# EAGLE design ENC28J60Breakout_V02 (EAGLE 8.0.0)
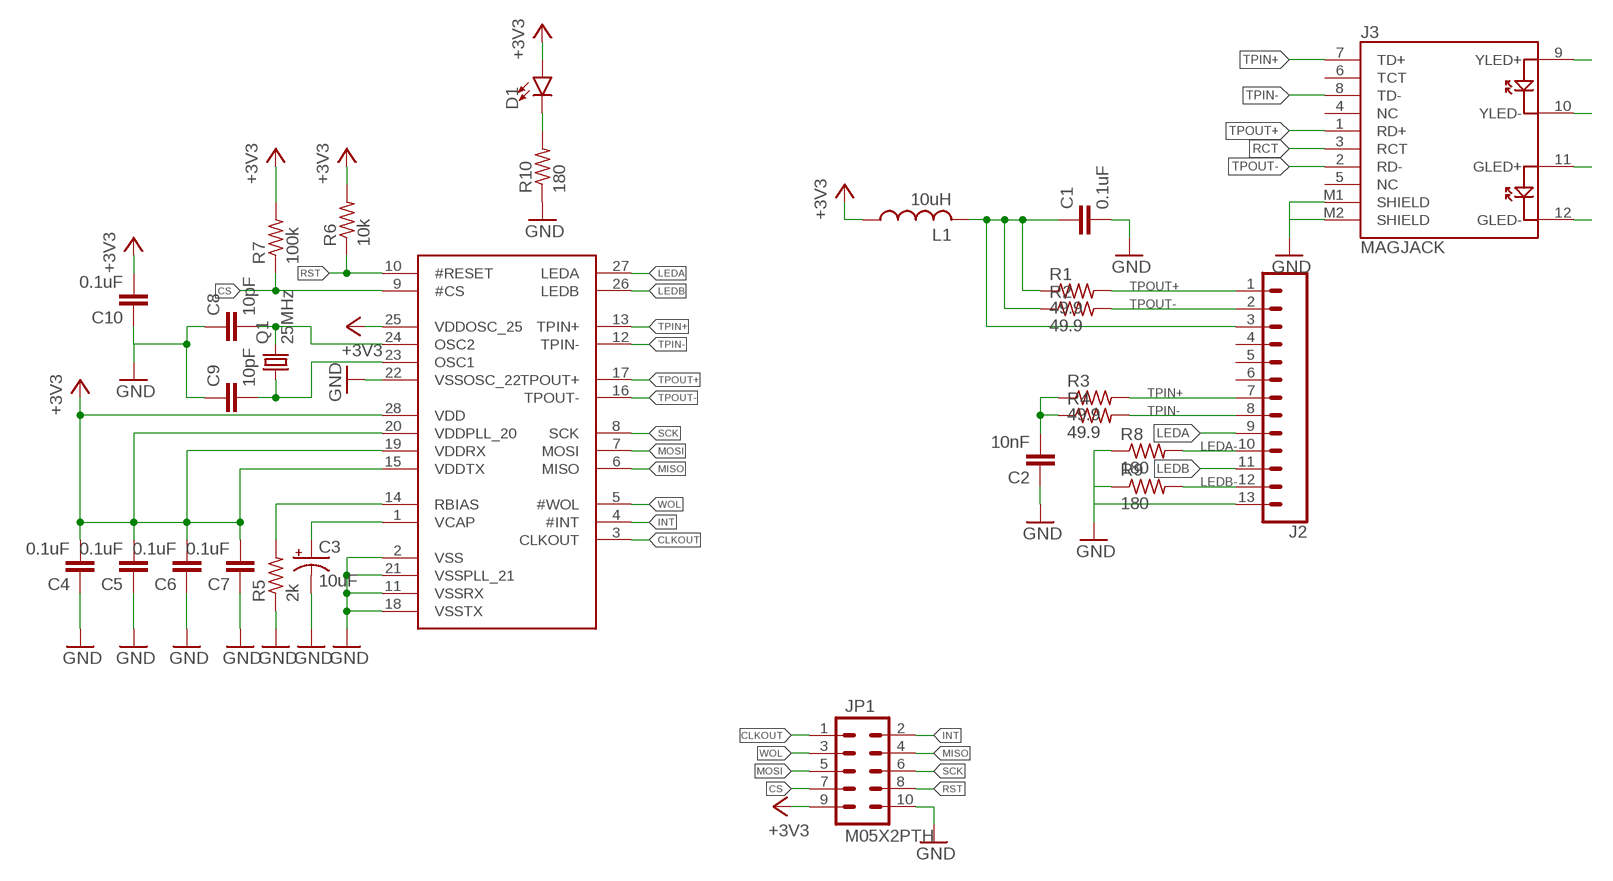
[diagram p0: schematic, sheet 1]

## Parts
C1  0.1uF  C-EU050-024X044  [C050-024X044]
C2  10nF  C-EU050-024X044  [C050-024X044]
C3  10uF  CPOL-USE2.5-7  [E2,5-7]
C4  0.1uF  C-EU050-024X044  [C050-024X044]
C5  0.1uF  C-EU050-024X044  [C050-024X044]
C6  0.1uF  C-EU050-024X044  [C050-024X044]
C7  0.1uF  C-EU050-024X044  [C050-024X044]
C8  10pF  C-EU050-024X044  [C050-024X044]
C9  10pF  C-EU050-024X044  [C050-024X044]
C10  0.1uF  C-EU050-024X044  [C050-024X044]
D1  LED5MM  [LED_5MM]
J2  CONN_13  [1X13]
J3  MAGJACK  [MAGJACK]
JP1  M05X2PTH  [AVR_ICSP]
L1  10uH  L-US0204/7  [0204/7]
Q1  25MHz  CRYSTALHC49S  [HC49/S]
R1  49.9  R-US_0204/7  [0204/7]
R2  49.9  R-US_0204/7  [0204/7]
R3  49.9  R-US_0204/7  [0204/7]
R4  49.9  R-US_0204/7  [0204/7]
R5  2k  R-US_0204/7  [0204/7]
R6  10k  R-US_0204/7  [0204/7]
R7  100k  R-US_0204/7  [0204/7]
R8  180  R-US_0204/7  [0204/7]
R9  180  R-US_0204/7  [0204/7]
R10  180  R-US_0204/7  [0204/7]
U$1  ENC28J60  [ENC28J60_DIP]

## Nets
+3V3: C4.2 C5.2 C6.2 C7.2 C10.2 D1.A JP1.9 L1.1 R6.2 R7.2 U$1.15(VDDTX) U$1.19(VDDRX) U$1.20(VDDPLL_20) U$1.25(VDDOSC_25) U$1.28(VDD)
CLKOUT: JP1.1 U$1.3(CLKOUT)
CS: JP1.7 R7.1 U$1.9(#CS)
GND: C1.2 C2.1 C3.- C4.1 C5.1 C6.1 C7.1 C8.1 C9.1 C10.1 J2.13 J3.M1(SHIELD) J3.M2(SHIELD) JP1.10 R5.1 R8.1 R9.1 R10.1 U$1.2(VSS) U$1.11(VSSRX) U$1.18(VSSTX) U$1.21(VSSPLL_21) U$1.22(VSSOSC_22)
INT: JP1.2 U$1.4(#INT)
LEDA: J2.9 J3.9(YLED+) U$1.27(LEDA)
LEDA-: J2.10 J3.10(YLED-) R8.2
LEDB: J2.11 J3.11(GLED+) U$1.26(LEDB)
LEDB-: J2.12 J3.12(GLED-) R9.2
MISO: JP1.4 U$1.6(MISO)
MOSI: JP1.5 U$1.7(MOSI)
N$3: C8.2 Q1.2 U$1.24(OSC2)
N$7: D1.K(C) R10.2
N$8: C9.2 Q1.1 U$1.23(OSC1)
N$9: C3.+ U$1.1(VCAP)
N$11: R5.2 U$1.14(RBIAS)
N$14: C2.2 R3.1 R4.1
RCT: C1.1 J2.3 J3.3(RCT) L1.2 R1.1 R2.1
RST: JP1.8 R6.1 U$1.10(#RESET)
SCK: JP1.6 U$1.8(SCK)
TPIN+: J2.7 J3.7(TD+) R3.2 U$1.13(TPIN+)
TPIN-: J2.8 J3.8(TD-) R4.2 U$1.12(TPIN-)
TPOUT+: J2.1 J3.1(RD+) R1.2 U$1.17(TPOUT+)
TPOUT-: J2.2 J3.2(RD-) R2.2 U$1.16(TPOUT-)
WOL: JP1.3 U$1.5(#WOL)
Unconnected: J2.4 J2.5 J2.6 J3.4(NC) J3.5(NC) J3.6(TCT)

## Library data of the parts
C1 C2 C4-C10 = rcl:C-EU: CAPACITOR, European symbol
C3 = rcl:CPOL-US: POLARIZED CAPACITOR, American symbol
D1 = SparkFun-LED:LED: LED (Generic) Standard schematic elements and footprints for 5mm, 3mm, 1206, and 0603 sized LEDs. Generic LEDs with no color specified.
J2 = SparkFun-Connectors:CONN_13: Multi connection point. Often used as Generic Header-pin footprint for 0.1 inch spaced/style header connections On any of the 0.1 inch spaced packages, you can populate with these: Break Away Headers - Straight <https://www.sparkfun.com/products/116> (PRT-00116) Break Away Male Headers - Right Angle <https://www.sparkfun.com/products/553> (PRT-00553) Female Headers <https://www.sparkfun.com/products/115> (PRT-00115) Break Away Headers - Machine Pin <https://www.sparkfun.com/products/117> (PRT-00117) Break Away Female Headers - Swiss Machine Pin <https://www.sparkfun.com/products/743> (PRT-00743) For SCREWTERMINALS and SPRING TERMINALS visit here: Screw Terimnals on SparkFun.com <https://www.sparkfun.com/search/results?term=Screw+Terminals> (5mm/3.5mm/2.54mm spacing) This device is also useful as a general connection point to wire up your design to another part of your project. Our various solder wires solder well into these plated through hole pads. Hook-Up Wire - Assortment (Stranded, 22 AWG) <https://www.sparkfun.com/products/11375> (PRT-11375) Hook-Up Wire - Assortment (Solid Core, 22 AWG) <https://www.sparkfun.com/products/11367> (PRT-11367) View the entire wire category on our website here <https://www.sparkfun.com/categories/141> Special notes: Molex polarized connector foot print use with SKU : PRT-08231 with associated crimp pins and housings. 1MM SMD Version SKU: PRT-10208 NOTES ON THE VARIANTS LOCK and LOCK_LONGPADS... This footprint was designed to help hold the alignment of a through-hole component (i.e. 6-pin header) while soldering it into place. You may notice that each hole has been shifted either up or down by 0.005 of an inch from it's more standard position (which is a perfectly straight line). This slight alteration caused the pins (the squares in the middle) to touch the edges of the holes. Because they are alternating, it causes a "brace" to hold the component in place. 0.005 has proven to be the perfect amount of "off-center" position when using our standard breakaway headers. Although looks a little odd when you look at the bare footprint, once you have a header in there, the alteration is very hard to notice. Also,if you push a header all the way into place, it is covered up entirely on the bottom side.
J3 = SparkFun-Connectors:MAGJACK: MAGJACK: RJ-45 with LEDs This is a single port, RJ45 ethernet jacks with built in transformer (magnetics), status LEDs, and shielding. Here is the connector we sell at SparkFun: RJ45 Ethernet MagJack-Compatible <https://www.sparkfun.com/products/8534> (PRT-08534) Datasheet <http://www.sparkfun.com/datasheets/Prototyping/MagJack.pdf> It is used on this SparkFun product: SparkFun RJ45 MagJack Breakout <https://www.sparkfun.com/products/13021> (BOB-13021); PROD_ID: CONN-09556; SF_ID: PRT-08534
JP1 = SparkFun-Connectors:M05X2: Header 5x2 Standard 10-pin dual row 0.1" header. Commonly used with AVR-ISP. Use with Spark Fun Electronics SKU: PRT-00778
L1 = rcl:L-US: INDUCTOR, American symbol
Q1 = adafruit:CRYSTAL: CRYSTAL; OC_FARNELL: 1667008; OC_NEWARK: unknown
R1-R10 = rcl:R-US_: RESISTOR, American symbol
U$1 = EzerLonginus:ENC28J60

## Board
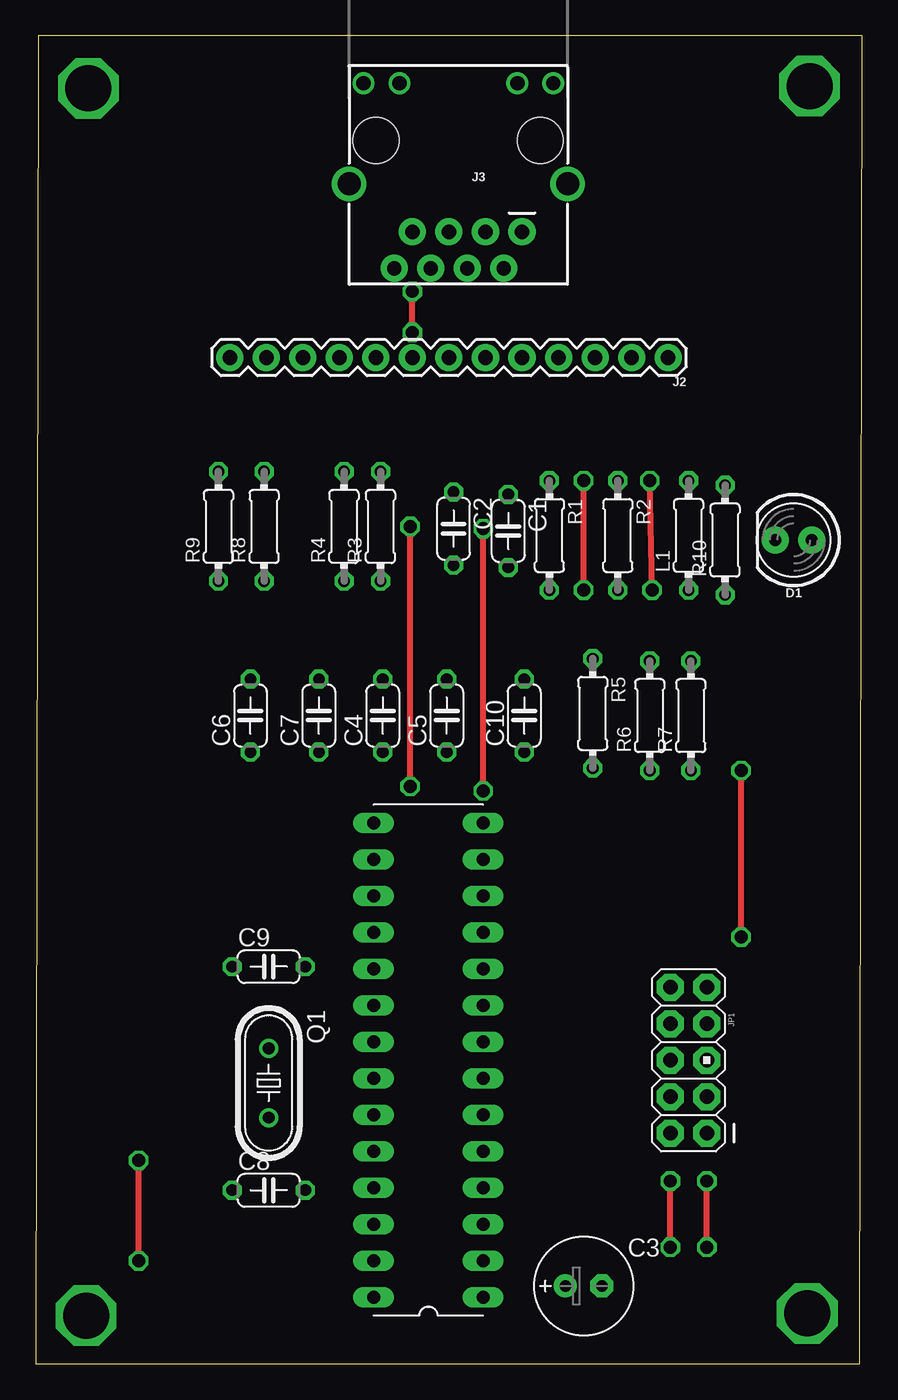
[diagram p1: board, top side]
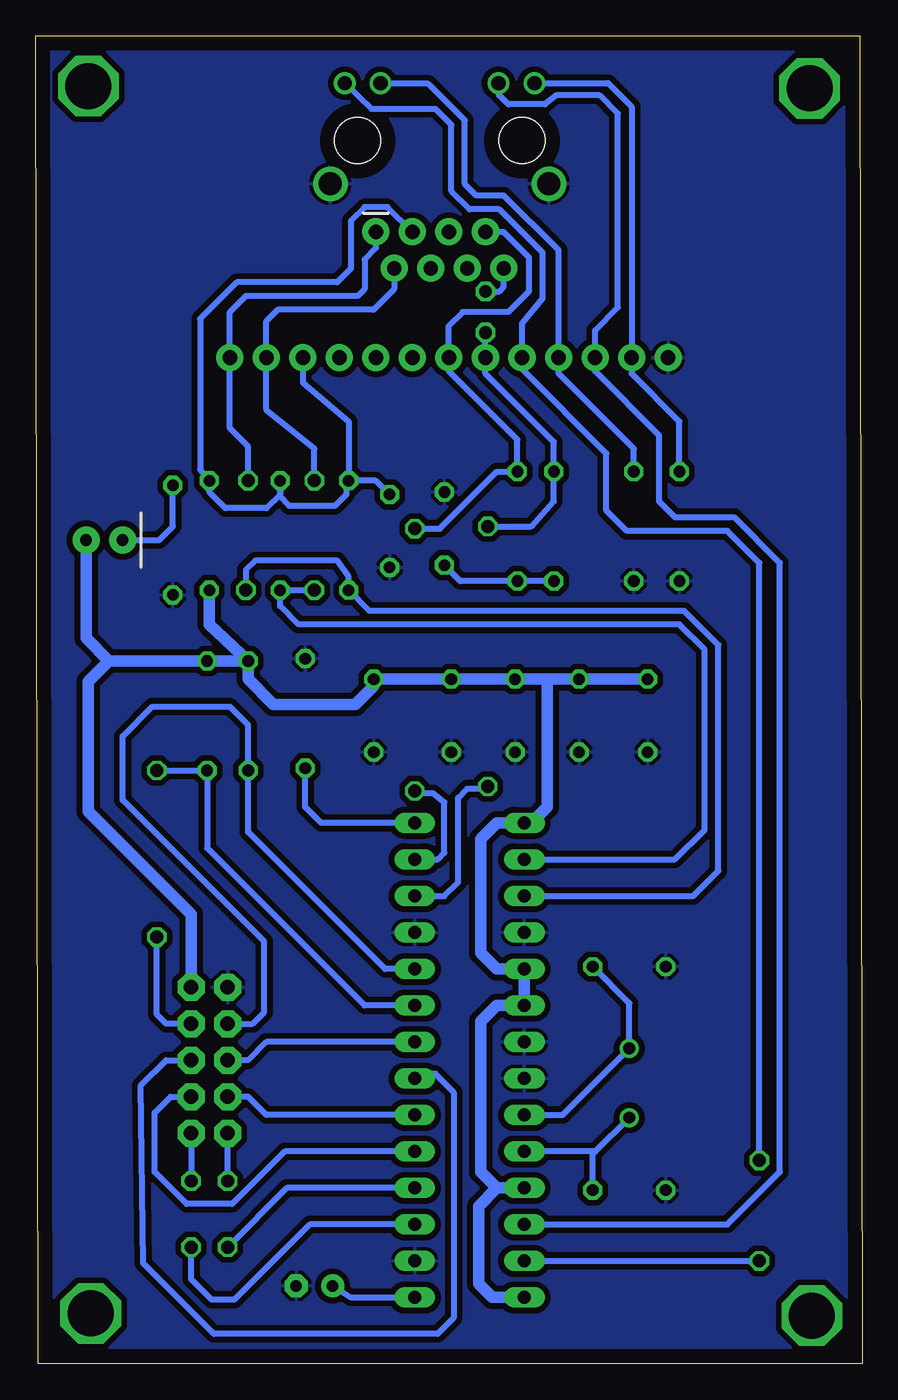
[diagram p2: board, bottom side, seen from below]

Size 57.47 x 92.39 mm. Coordinates in mm from the lower left corner, seen from the top.
Outline: 0,0 57.31,0 57.47,92.39 0.16,92.39 0,0
Copper layers (1*16): Top 0.035mm / dielectric 1.5mm / Bottom 0.035mm
Design rules "default": minimum track width 10mil, minimum drill 24mil, track to track 8mil, track to pad 8mil, pad to pad 8mil, via to via 8mil, smd to smd 8mil, copper to edge 40mil, drill to drill 8mil, minimum pad ring 10mil, minimum via ring 8mil, stop-mask expansion 4mil, vias tented up to drill 0mil, thermal gap 10mil

### Footprints (pad centres in the part's own frame; a part is rotated, then mirrored left to right if it is on the bottom)
C050-024X044 = drill 0.813 octagon: 1 -2.54,0; 2 2.54,0
E2,5-7 = drill 0.813 pad 1.6: + -1.27,0 | drill 0.813 pad 1.6 octagon: - 1.27,0
LED_5MM = drill 0.813 pad 1.88: A -1.27,0; K 1.27,0
1X13 = drill 1.016 pad 1.88: 1 0,0; 2 2.54,0; 3 5.08,0; 4 7.62,0; 5 10.16,0; 6 12.7,0; 7 15.24,0; 8 17.78,0; 9 20.32,0; 10 22.86,0; 11 25.4,0; 12 27.94,0; 13 30.48,0
MAGJACK = drill 1 pad 1.88: 1 3.175,17.445; 2 4.445,19.985; 3 5.715,17.445; 4 6.985,19.985; 5 8.255,17.445; 6 9.525,19.985; 7 10.795,17.445; 8 12.065,19.985 | drill 1 pad 1.27: 9 1,7.1; 10 3.5,7.1; 11 11.7,7.1; 12 14.2,7.1 | drill 1.6 pad 2.184: M1 0,14.1; M2 15.2,14.1 | hole 3.2: 1.905,11.095; 13.335,11.095
AVR_ICSP = drill 1.016 pad 1.88 octagon: 1 -1.27,5.08; 2 1.27,5.08; 3 -1.27,2.54; 4 1.27,2.54; 5 -1.27,0; 6 1.27,0; 7 -1.27,-2.54; 8 1.27,-2.54; 9 -1.27,-5.08; 10 1.27,-5.08
0204/7 = drill 0.813 octagon: 1 -3.81,0; 2 3.81,0
HC49/S = drill 0.813: 1 -2.413,0; 2 2.413,0
ENC28J60_DIP = drill 0.9 pad 1.422 long: 1 -3.81,16.51; 2 -3.81,13.97; 3 -3.81,11.43; 4 -3.81,8.89; 5 -3.81,6.35; 6 -3.81,3.81; 7 -3.81,1.27; 8 -3.81,-1.27; 9 -3.81,-3.81; 10 -3.81,-6.35; 11 -3.81,-8.89; 12 -3.81,-11.43; 13 -3.81,-13.97; 14 -3.81,-16.51; 15 3.81,-16.51; 16 3.81,-13.97; 17 3.81,-11.43; 18 3.81,-8.89; 19 3.81,-6.35; 20 3.81,-3.81; 21 3.81,-1.27; 22 3.81,1.27; 23 3.81,3.81; 24 3.81,6.35; 25 3.81,8.89; 26 3.81,11.43; 27 3.81,13.97; 28 3.81,16.51

### Placement (x,y rotation side)
C1  32.86,57.94 270 top
C2  29.05,58.1 270 top
C3  38.1,5.4 0 top
C4  24.13,45.09 90 top
C5  28.57,45.09 90 top
C6  14.92,45.09 90 top
C7  19.68,45.09 90 top
C8  16.19,12.06 0 top
C9  16.19,27.62 0 top
C10  33.97,45.09 90 top
D1  52.7,57.31 180 top
J2  43.97,70.01 180 top
J3  36.99,96.2 180 top
JP1  45.4,21.11 180 top
L1  45.4,57.63 90 top
Q1  16.19,19.53 270 top
R1  35.72,57.63 270 top
R2  40.48,57.63 270 top
R3  23.97,58.26 90 top
R4  21.43,58.26 90 top
R5  38.73,45.24 270 top
R6  42.7,45.09 90 top
R7  45.56,45.09 90 top
R8  15.88,58.26 90 top
R9  12.7,58.26 90 top
R10  47.94,57.31 90 top
U$1  27.3,21.11 180 top

### Tracks (layer width: path | path; a pad name or v marks a point on that pad's centre or on a via)
+3V3
  Bottom 0.813: 52.39,48.9 R7.2 R6.2 | 52.39,48.9 53.82,47.47 53.82,38.42 46.67,31.27 JP1.9 | C6.2 C7.2 21.91,47.62 | 21.91,47.62 C4.2 C5.2 C10.2 33.97,47.15 35.24,45.88 40.96,45.88 42.7,47.62 R6.2 | 21.91,47.62 21.91,38.73 23.02,37.62 U$1.15 25.4,37.62 26.51,36.51 26.51,28.57 25.4,27.46 U$1.19 U$1.20 25.4,24.92 26.51,23.81 26.51,13.34 25.4,12.22 | 25.4,12.22 U$1.25 | U$1.28 25.72,4.6 26.67,5.56 26.67,10.95 25.4,12.22 | D1.A 53.98,50.48 52.39,48.9 | L1.1 45.4,51.44 R6.2
CLKOUT  (via drill 0.9)
  Top 0.406: v46.67,8.1 v46.67,12.7
  Bottom 0.406: U$1.3 38.42,9.68 43.66,4.45 45.24,4.45 46.67,5.87 v46.67,8.1 | JP1.1 v46.67,12.7
CS  (via drill 0.9)
  Top 0.406: v49.05,29.69 v49.05,41.27
  Bottom 0.406: U$1.9 34.61,24.92 45.56,35.88 R7.1 v49.05,41.27 | JP1.7 48.42,23.65 49.05,24.29 v49.05,29.69
GND
  pour Bottom (isolate 0.406): -0.16,92.39 57.47,92.39 57.31,0.32 0.16,0.48
INT  (via drill 0.9)
  Top 0.406: v44.13,8.1 v44.13,12.7
  Bottom 0.406: v44.13,12.7 JP1.2 | U$1.4 40.01,12.22 v44.13,8.1
LEDA  (via drill 0.9)
  Top 0.406: v7.14,7.14 v7.14,14.13
  Bottom 0.406: J3.9 34.13,87.31 29.69,87.31 28.57,86.2 28.57,81.6 27.3,80.33 25.24,80.33 22.23,77.31 22.23,74.14 23.65,72.39 J2.9 23.65,69.22 17.78,63.34 17.78,59.37 16.35,57.94 9.37,57.94 7.14,55.72 v7.14,14.13 | U$1.27 v7.14,7.14
LEDA-
  Bottom 0.406: J3.10 33.45,89.06 30.16,89.06 27.62,86.52 27.62,82.07 26.83,81.28 24.92,81.28 21.11,77.47 J2.10 21.11,68.9 15.88,63.66 R8.2
LEDB
  Bottom 0.406: J3.11 25.24,88.99 25.24,88.27 24.61,87.63 22.07,87.63 21.27,88.27 18.26,88.27 16.99,87 16.99,73.5 18.57,71.91 J2.11 18.57,69.06 14.13,64.61 14.13,60.01 13.02,58.9 8.89,58.9 5.71,55.72 5.71,13.34 9.37,9.68 U$1.26
LEDB-
  Bottom 0.406: 22.75,89.06 J3.12 17.66,89.1 16.03,87.47 J2.12 16.03,68.9 12.7,65.56 R9.2
MISO
  Bottom 0.406: U$1.6 41.43,17.3 42.7,18.57 JP1.4
MOSI
  Bottom 0.406: U$1.7 30.8,20.16 29.69,20.16 28.42,18.89 28.42,3.17 29.53,2.06 45.09,2.06 50.01,6.99 50.16,19.37 48.42,21.11 JP1.5
N$1  (via drill 3.2)
  other vias: 53.82,88.9
N$3
  Bottom 0.406: 18.54,14.76 U$1.24 | 18.54,14.76 Q1.2 | C8.2 18.73,14.57 18.54,14.76
N$4  (via drill 3.2)
  other vias: 3.65,88.74
N$5  (via drill 3.2)
  other vias: 3.49,3.33
N$6  (via drill 3.2)
  other vias: 53.66,3.49
N$7
  Bottom 0.406: D1.K 48.9,57.31 47.94,58.26 R10.2
N$8
  Bottom 0.406: U$1.23 20.83,17.3 Q1.1 16.19,25.08 C9.2
N$9
  Bottom 0.406: C3.+ 35.56,4.6 U$1.1
N$11
  Bottom 0.406: U$1.14 37.62,37.62 38.73,38.73 R5.2
N$14
  Bottom 0.406: R4.1 R3.1 27.94,54.45 C2.2
RCT
  Bottom 0.406: J3.3 31.29,78.76 33.02,80.49 34.61,80.49 35.56,79.53 35.56,76.2 36.51,75.25 43.5,75.25 46.04,72.71 46.04,62.23 L1.2 45.4,60.64 44.29,59.53 41.43,59.53 40.48,60.48 R2.1 40.48,60.33 39.85,59.69 36.67,59.69 35.88,60.48 35.88,61.44 R1.1 | C1.1 33.81,61.44 R1.1 | J2.3 38.89,68.26 35.72,65.56 R1.1
RST
  Bottom 0.406: U$1.10 33.18,27.46 42.7,36.99 R6.1 42.7,44.45 43.97,45.72 49.37,45.72 51.44,43.66 51.44,39.21 41.59,29.37 41.59,24.45 42.39,23.65 JP1.8
SCK
  Bottom 0.406: U$1.8 41.43,22.38 42.7,21.11 JP1.6
TPIN+  (via drill 0.9)
  Top 0.406: v31.11,39.85 v31.11,58.1
  Bottom 0.406: J3.7 24.94,78.76 23.18,76.99 23.18,74.61 24.61,73.18 27.78,73.18 28.73,72.23 J2.7 28.73,69.06 23.97,64.29 R3.2 | U$1.13 29.53,35.08 29.05,35.56 29.05,39.05 29.84,39.69 30.96,39.69 v31.11,39.85 | R3.2 24.45,62.07 | v31.11,58.1 29.37,58.1 25.4,62.07 R3.2
TPIN-  (via drill 0.9)
  Top 0.406: v26.19,71.75 v26.19,74.61 | v26.04,40.16 v26.04,58.26
  Bottom 0.406: v26.19,71.75 J2.8 26.19,68.9 21.43,64.14 R4.2 21.43,60.01 23.02,58.26 v26.04,58.26 | v26.19,74.61 25.24,74.61 24.92,74.93 J3.8 | U$1.12 29.05,32.54 28.1,33.5 28.1,39.37 27.46,40.01 26.35,40.01 26.19,40.16 v26.04,40.16
TPOUT+  (via drill 0.9)
  Top 0.406: v42.86,53.82 v42.7,61.44
  Bottom 0.406: J3.1 33.81,77.63 34.61,76.83 34.61,74.77 35.08,74.3 42.86,74.3 43.97,73.18 J2.1 43.97,65.09 42.7,63.82 v42.7,61.44 | U$1.17 11.75,32.54 10,34.29 10,50.01 12.38,52.39 34.29,52.39 R1.2 35.72,54.77 36.51,55.88 42.23,55.88 42.86,55.24 v42.86,53.82
TPOUT-  (via drill 0.9)
  Top 0.406: v38.1,53.82 v38.1,61.44
  Bottom 0.406: J3.2 32.54,74.77 33.97,73.34 40.64,73.34 41.43,72.55 J2.2 41.43,66.36 38.1,63.66 v38.1,61.44 | U$1.16 13.02,35.08 10.95,37.15 10.95,49.69 12.7,51.44 39.21,51.44 40.48,52.7 R2.2 v38.1,53.82
WOL
  Bottom 0.406: U$1.5 40.16,14.76 43.81,11.11 46.99,11.11 49.21,13.34 49.21,17.46 48.1,18.57 JP1.3